# Altium schematic sheet 单片机控制电路.SchDoc
size A4; Time: 22/05/16
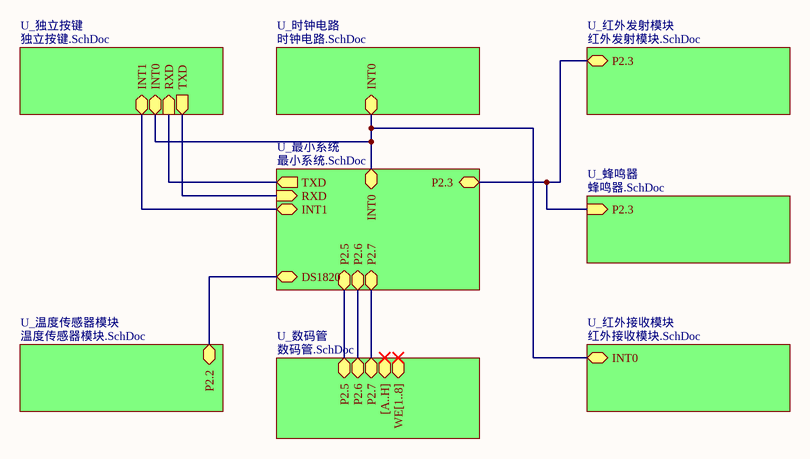
[diagram p0: 单片机控制电路.SchDoc]

## Sub-sheets
U_数码管 = 数码管.SchDoc: P2.5 (bidir), P2.6 (bidir), P2.7 (bidir), [A..H] (bidir), WE[1..8] (bidir)
U_时钟电路 = 时钟电路.SchDoc: INT0 (bidir)
U_最小系统 = 最小系统.SchDoc: P2.5 (bidir), P2.6 (bidir), P2.7 (bidir), P2.3 (bidir), DS1820 (bidir), RXD (in), TXD (out), INT0 (bidir), INT1 (bidir)
U_温度传感器模块 = 温度传感器模块.SchDoc: P2.2 (bidir)
U_独立按键 = 独立按键.SchDoc: TXD (out), RXD (in), INT0 (bidir), INT1 (bidir)
U_红外发射模块 = 红外发射模块.SchDoc: P2.3 (bidir)
U_红外接收模块 = 红外接收模块.SchDoc: INT0 (bidir)
U_蜂鸣器 = 蜂鸣器.SchDoc: P2.3 (in)

## Nets
(unnamed): sheet U_最小系统/P2.5, sheet U_数码管/P2.5
(unnamed): sheet U_最小系统/P2.6, sheet U_数码管/P2.6
(unnamed): sheet U_最小系统/P2.7, sheet U_数码管/P2.7
(unnamed): sheet U_最小系统/P2.3, sheet U_红外发射模块/P2.3, sheet U_蜂鸣器/P2.3
(unnamed): sheet U_最小系统/DS1820, sheet U_温度传感器模块/P2.2
(unnamed): sheet U_最小系统/RXD, sheet U_独立按键/TXD
(unnamed): sheet U_最小系统/TXD, sheet U_独立按键/RXD
(unnamed): sheet U_最小系统/INT0, sheet U_时钟电路/INT0, sheet U_独立按键/INT0, sheet U_红外接收模块/INT0
(unnamed): sheet U_最小系统/INT1, sheet U_独立按键/INT1

## Notes on the sheet
- 专升本
- 通信工程
- 李烨攀
- 2101班
- 210806300163
- 学号